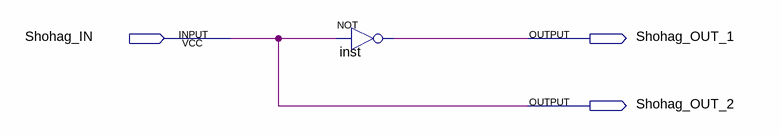
[diagram p0: schematic sheet]
// Quartus schematic Shohag_1to2Decoder_block.bdf as structural Verilog: 1 symbols, 3 pins
module Shohag_1to2Decoder_block (
  input  Shohag_IN,
  output Shohag_OUT_1,
  output Shohag_OUT_2
);

  not inst (Shohag_OUT_1, Shohag_IN);

  assign Shohag_OUT_2 = Shohag_IN;
endmodule
